# EAGLE design ArduinoV01 (EAGLE 7.7.0)
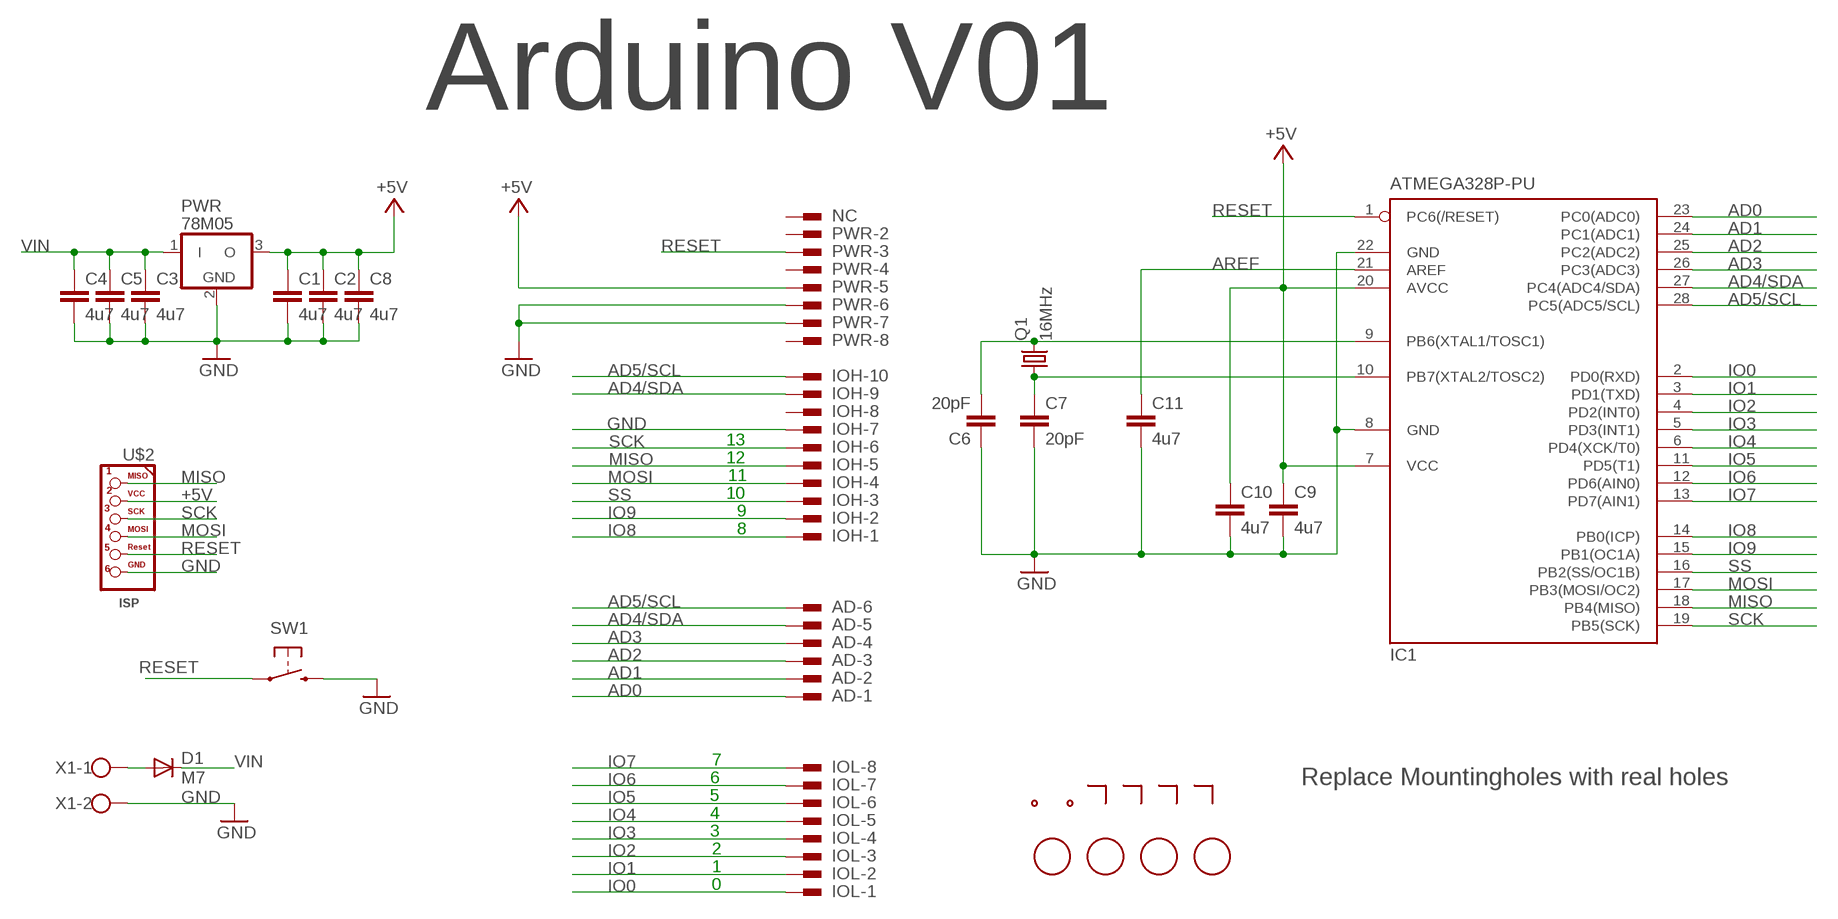
[diagram p0: schematic, sheet 1]

## Parts
AD-1  PINHD-1X1  [1X01]
AD-2  PINHD-1X1  [1X01]
AD-3  PINHD-1X1  [1X01]
AD-4  PINHD-1X1  [1X01]
AD-5  PINHD-1X1  [1X01]
AD-6  PINHD-1X1  [1X01]
C1  4u7  C-EUC0805  [C0805]
C2  4u7  C-EUC0805  [C0805]
C3  4u7  C-EUC0805  [C0805]
C4  4u7  C-EUC0805  [C0805]
C5  4u7  C-EUC0805  [C0805]
C6  20pF  C-EUC0805  [C0805]
C7  20pF  C-EUC0805  [C0805]
C8  4u7  C-EUC0805  [C0805]
C9  4u7  C-EUC0805  [C0805]
C10  4u7  C-EUC0805  [C0805]
C11  4u7  C-EUC0805  [C0805]
D1  M7  DIODE-DO214AC  [DO214AC]
FD1  FIDUCIALMOUNT  [FIDUCIA-MOUNT]
FD2  FIDUCIALMOUNT  [FIDUCIA-MOUNT]
FD3  FIDUCIALMOUNT  [FIDUCIA-MOUNT]
FD4  FIDUCIALMOUNT  [FIDUCIA-MOUNT]
IC1  ATMEGA328P-PU  [DIL28-3]
IOH-1  PINHD-1X1  [1X01]
IOH-2  PINHD-1X1  [1X01]
IOH-3  PINHD-1X1  [1X01]
IOH-4  PINHD-1X1  [1X01]
IOH-5  PINHD-1X1  [1X01]
IOH-6  PINHD-1X1  [1X01]
IOH-7  PINHD-1X1  [1X01]
IOH-8  PINHD-1X1  [1X01]
IOH-9  PINHD-1X1  [1X01]
IOH-10  PINHD-1X1  [1X01]
IOL-1  PINHD-1X1  [1X01]
IOL-2  PINHD-1X1  [1X01]
IOL-3  PINHD-1X1  [1X01]
IOL-4  PINHD-1X1  [1X01]
IOL-5  PINHD-1X1  [1X01]
IOL-6  PINHD-1X1  [1X01]
IOL-7  PINHD-1X1  [1X01]
IOL-8  PINHD-1X1  [1X01]
NC  PINHD-1X1  [1X01]
PWR  78M05  7805DPACK  [DPACK]
PWR-2  PINHD-1X1  [1X01]
PWR-3  PINHD-1X1  [1X01]
PWR-4  PINHD-1X1  [1X01]
PWR-5  PINHD-1X1  [1X01]
PWR-6  PINHD-1X1  [1X01]
PWR-7  PINHD-1X1  [1X01]
PWR-8  PINHD-1X1  [1X01]
Q1  16MHz  CRYSTALHC49S  [HC49/S]
SW1  SWITCH1X2  [SW8X4-SMD]
U$1  MARKERDUAL-90  [MARKER90]
U$2  ISPE  [2X03EDGE]
U$3  MARKER  [MARKER]
U$4  MARKER  [MARKER]
U$5  MARKER  [MARKER]
U$6  MARKER  [MARKER]
X1  SCREWTERMINATOR1X2V  [W237-102V]

## Nets
+5V [usbvcc]: C1.1 C2.1 C8.1 C9.1 C10.1 IC1.7(VCC) IC1.20(AVCC) PWR-5.1 PWR.3(O) U$2.P$2
AD0: AD-1.1 IC1.23(PC0(ADC0))
AD1: AD-2.1 IC1.24(PC1(ADC1))
AD2: AD-3.1 IC1.25(PC2(ADC2))
AD3: AD-4.1 IC1.26(PC3(ADC3))
AD4/SDA: AD-5.1 IC1.27(PC4(ADC4/SDA)) IOH-9.1
AD5/SCL: AD-6.1 IC1.28(PC5(ADC5/SCL)) IOH-10.1
AREF [aref]: C11.1 IC1.21(AREF)
GND [gnd]: C1.2 C2.2 C3.2 C4.2 C5.2 C6.1 C7.2 C8.2 C9.2 C10.2 C11.2 IC1.8(GND) IC1.22(GND) IOH-7.1 PWR-6.1 PWR-7.1 PWR.2(GND) SW1.2(S) U$2.P$6 X1.2
IO0: IC1.2(PD0(RXD)) IOL-1.1
IO1: IC1.3(PD1(TXD)) IOL-2.1
IO2: IC1.4(PD2(INT0)) IOL-3.1
IO3: IC1.5(PD3(INT1)) IOL-4.1
IO4: IC1.6(PD4(XCK/T0)) IOL-5.1
IO5: IC1.11(PD5(T1)) IOL-6.1
IO6: IC1.12(PD6(AIN0)) IOL-7.1
IO7: IC1.13(PD7(AIN1)) IOL-8.1
IO8: IC1.14(PB0(ICP)) IOH-1.1
IO9: IC1.15(PB1(OC1A)) IOH-2.1
MISO: IC1.18(PB4(MISO)) IOH-5.1 U$2.P$1
MOSI: IC1.17(PB3(MOSI/OC2)) IOH-4.1 U$2.P$4
N$1: C6.2 IC1.9(PB6(XTAL1/TOSC1)) Q1.2
N$2: C7.1 IC1.10(PB7(XTAL2/TOSC2)) Q1.1
N$3: D1.A X1.1
RESET: IC1.1(PC6(/RESET)) PWR-3.1 SW1.1(P) U$2.P$5
SCK: IC1.19(PB5(SCK)) IOH-6.1 U$2.P$3
SS: IC1.16(PB2(SS/OC1B)) IOH-3.1
VIN [power]: C3.1 C4.1 C5.1 D1.C PWR.1(I)
Unconnected: IOH-8.1 NC.1 PWR-2.1 PWR-4.1 PWR-8.1

## Notes on the sheet
- Arduino V01
- 13
- 12
- 11
- 10
- 9
- 8
- 7
- 6 | Replace Mountingholes with real holes
- 5
- 4
- 3
- 2
- 1
- 0

## Library data of the parts
AD-1-AD-6 IOH-1-IOH-10 IOL-1-IOL-8 NC PWR-2-PWR-8 = MyLib:PINHD-1X1: Connector 1 pin; MF: TYCO ELECTRONICS; MPN: 62221-1; OC_FARNELL: unknown; OC_NEWARK: 16H2318
C1-C11 = rcl:C-EU: CAPACITOR, European symbol
D1 = MyLib:DIODE: DIODE Diode
FD1-FD4 = SmartPrj:FIDUCIALMOUNT
IC1 = Itead_IC_110429:ATMEGA328P-PU: ICC002
PWR = MyLib:7805: Voltage regulator 3 pin
Q1 = MyLib:CRYSTAL: CRYSTAL; OC_FARNELL: 1667008; OC_NEWARK: unknown
SW1 = MyLib:SWITCH1X2
U$1 = MyLib:MARKERDUAL: Marker for Duallayer boards
U$2 = MyLib:ISP
U$3-U$6 = MyLib:MARKER: Marker pad without connections
X1 = MyLib:SCREWTERMINATOR1X2: WAGO SCREW CLAMP

## Net classes
0 default: width 0.254 mm, clearance 0.254 mm
1 power: width 0.61 mm, drill 0.61 mm, clearance 0.254 mm
2 gnd: width 0.305 mm, drill 0.559 mm, clearance 0.254 mm
3 usbvcc: width 0.508 mm, drill 0.61 mm, clearance 0.254 mm
4 aref: width 0.406 mm, drill 0.61 mm, clearance 0.254 mm

## Board
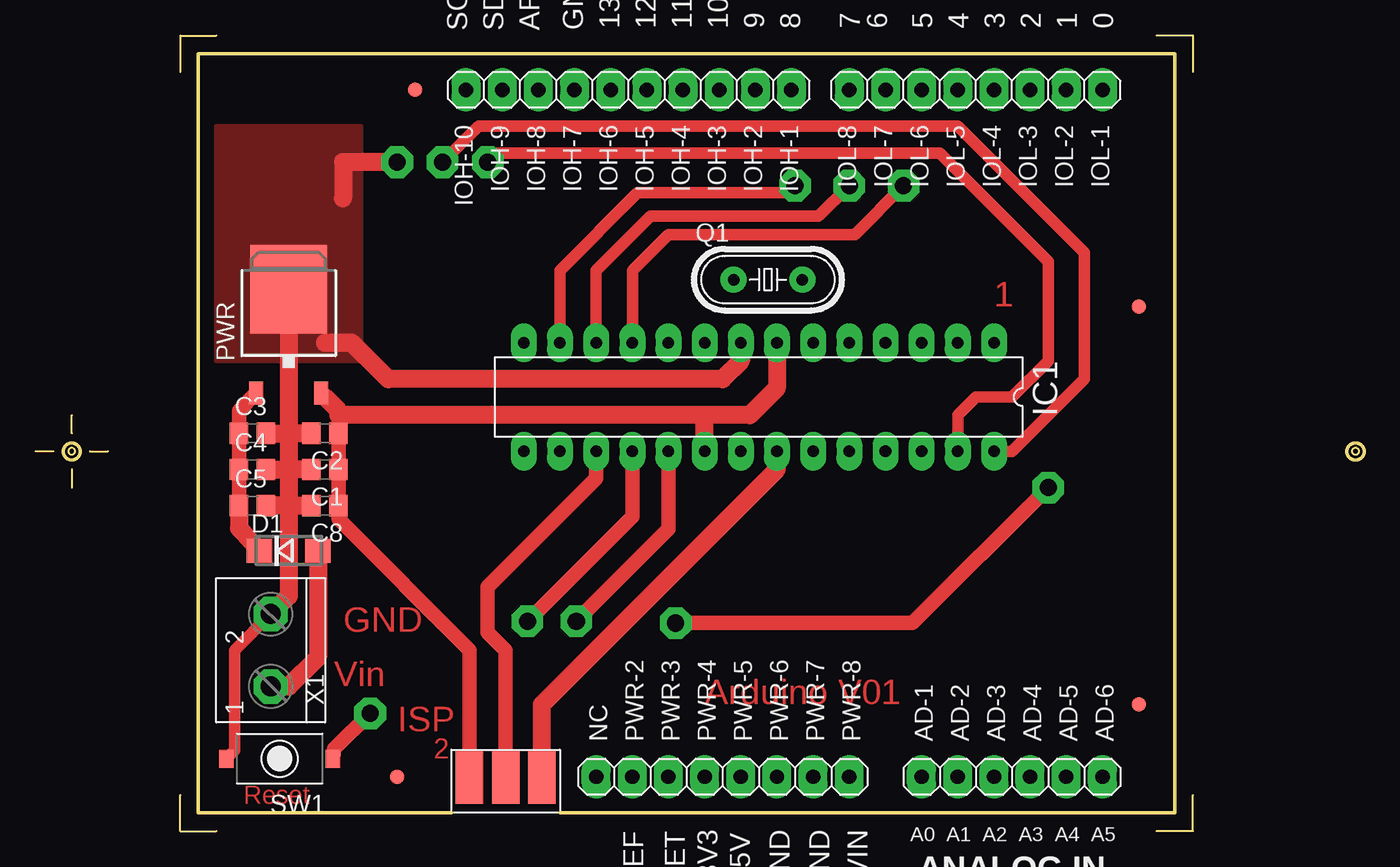
[diagram p1: board, top side]
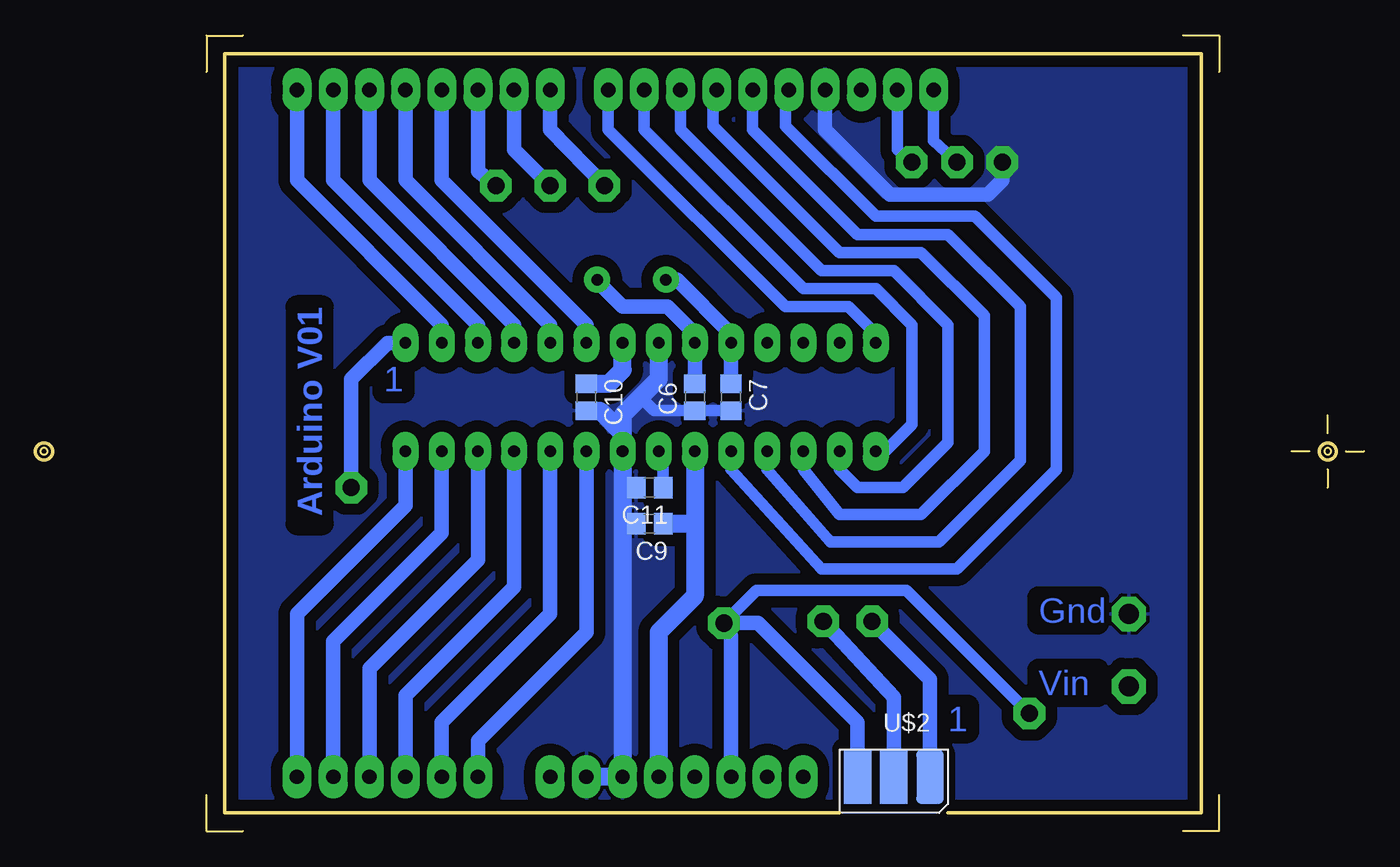
[diagram p2: board, bottom side, seen from below]

Size 93.29 x 55.88 mm. Coordinates in mm from the lower left corner, seen from the top.
Outline: 36.83,1.27 80.01,1.27 80.01,54.61 11.43,54.61 11.43,1.27 29.21,1.27
Copper layers (1*16): Top 0.035mm / dielectric 1.5mm / Bottom 0.035mm
Design rules "default *": minimum track width 10mil, minimum drill 22mil, track to track 16mil, track to pad 16mil, pad to pad 10mil, via to via 16mil, smd to smd 8mil, copper to edge 26mil, drill to drill 12mil, minimum pad ring 20mil, minimum via ring 20mil, stop-mask expansion 1mil, vias tented up to drill 30mil, thermal gap 10mil

### Footprints (pad centres in the part's own frame; a part is rotated, then mirrored left to right if it is on the bottom)
1X01 = drill 1.016 long: 1 0,0
C0805 = smd 1.3 x 1.5: 1 -0.95,0; 2 0.95,0
DO214AC = smd 1.8 x 1.7: A 2.05,0; C -2.05,0
FIDUCIA-MOUNT = smd 1.016 x 1.016: P$1 0,0
DIL28-3 = drill 0.813 long: 1 -16.51,-3.81; 2 -13.97,-3.81; 3 -11.43,-3.81; 4 -8.89,-3.81; 5 -6.35,-3.81; 6 -3.81,-3.81; 7 -1.27,-3.81; 8 1.27,-3.81; 9 3.81,-3.81; 10 6.35,-3.81; 11 8.89,-3.81; 12 11.43,-3.81; 13 13.97,-3.81; 14 16.51,-3.81; 15 16.51,3.81; 16 13.97,3.81; 17 11.43,3.81; 18 8.89,3.81; 19 6.35,3.81; 20 3.81,3.81; 21 1.27,3.81; 22 -1.27,3.81; 23 -3.81,3.81; 24 -6.35,3.81; 25 -8.89,3.81; 26 -11.43,3.81; 27 -13.97,3.81; 28 -16.51,3.81
DPACK = smd 1 x 1.6: 1 -2.28,-4.8; 3 2.28,-4.8 | smd 5.4 x 6.2: 2 0,2.5
HC49/S = drill 0.813: 1 -2.413,0; 2 2.413,0
SW8X4-SMD = smd 1.27 x 1.016: 1 0,-3.75; 2 0,3.75
2X03EDGE = smd 1.93 x 3.81: P$1 2.54,0; P$3 0,0; P$5 -2.54,0 | smd 1.93 x 3.81 bottom: P$2 2.54,0; P$4 0,0; P$6 -2.54,0
W237-102V = drill 1.4 pad 2.3 octagon: 1 -2.54,0; 2 2.54,0

### Placement (x,y rotation side)
AD-1  62.23,3.81 0 top
AD-2  64.77,3.81 0 top
AD-3  67.31,3.81 0 top
AD-4  69.85,3.81 0 top
AD-5  72.39,3.81 0 top
AD-6  74.93,3.81 0 top
C1  20.32,25.4 180 top
C2  20.32,27.94 180 top
C3  15.24,27.94 0 top
C4  15.24,25.4 0 top
C5  15.24,22.86 0 top
C6  46.99,30.48 90 bottom
C7  44.45,30.48 270 bottom
C8  20.32,22.86 180 top
C9  50.16,21.59 180 bottom
C10  54.61,30.48 270 bottom
C11  50.16,24.13 180 bottom
D1  17.78,19.68 0 top
FD1  26.67,52.07 0 top
FD2  77.47,8.89 0 top
FD3  25.4,3.81 0 top
FD4  77.47,36.83 0 top
IC1  50.8,30.48 180 top
IOH-1  53.09,52.07 180 top
IOH-2  50.55,52.07 180 top
IOH-3  48.01,52.07 180 top
IOH-4  45.47,52.07 180 top
IOH-5  42.93,52.07 180 top
IOH-6  40.39,52.07 180 top
IOH-7  37.85,52.07 180 top
IOH-8  35.31,52.07 180 top
IOH-9  32.77,52.07 180 top
IOH-10  30.23,52.07 180 top
IOL-1  74.93,52.07 180 top
IOL-2  72.39,52.07 180 top
IOL-3  69.85,52.07 180 top
IOL-4  67.31,52.07 180 top
IOL-5  64.77,52.07 180 top
IOL-6  62.23,52.07 180 top
IOL-7  59.69,52.07 180 top
IOL-8  57.15,52.07 180 top
NC  39.37,3.81 0 top
PWR  17.78,35.56 0 top
PWR-2  41.91,3.81 0 top
PWR-3  44.45,3.81 0 top
PWR-4  46.99,3.81 0 top
PWR-5  49.53,3.81 0 top
PWR-6  52.07,3.81 0 top
PWR-7  54.61,3.81 0 top
PWR-8  57.15,3.81 0 top
Q1  51.44,38.74 0 top
SW1  17.14,5.08 90 top
U$1  2.54,26.67 0 top
U$2  33.02,3.81 0 bottom
U$3  10.16,55.88 0 top
U$4  81.28,55.88 270 top
U$5  10.16,0 90 top
U$6  81.28,0 180 top
X1  16.51,12.7 90 top

### Tracks (layer width: path | path; a pad name or v marks a point on that pad's centre or on a via)
+5V
  Top 1.016: PWR.3 21.27,29.55 21.27,29.21 C2.1 C1.1 C8.1 21.27,21.91 30.48,12.7 U$2.P$2
  Top 1.27: IC1.7 52.07,31.11 50.16,29.21 46.99,29.21 | 46.99,29.21 21.27,29.21 21.27,29.53 20.32,30.48 | IC1.20 46.99,29.21
  Bottom 1.27: IC1.20 46.99,21.59 | 46.99,21.59 46.99,16.51 49.53,13.97 PWR-5.1 | C10.1 53.02,31.43 52.07,32.38 IC1.7 | C9.1 46.99,21.59
AD0
  Bottom 1.016: IC1.23 54.61,13.97 62.23,6.35 AD-1.1
AD1
  Bottom 1.016: IC1.24 57.15,15.24 64.77,7.62 AD-2.1
AD2
  Bottom 1.016: IC1.25 59.69,17.14 67.31,9.53 AD-3.1
AD3
  Bottom 1.016: AD-4.1 69.85,11.43 62.23,19.05 IC1.26
AD4/SDA  (via drill 1.2 pad 2)
  Top 0.813: v31.75,46.99 32.38,47.62 63.5,47.62 71.12,40.01 71.12,33.02 68.58,30.48 66.04,30.48 64.77,29.21 IC1.27
  Bottom 0.813: IOH-9.1 32.77,47.88 v31.75,46.99
  Bottom 1.016: AD-5.1 72.39,13.33 64.77,20.95 IC1.27
AD5/SCL  (via drill 1.2 pad 2)
  Top 0.813: v28.57,46.99 31.11,49.53 64.77,49.53 73.66,40.64 73.66,31.75 68.58,26.67 IC1.28
  Bottom 0.813: IOH-10.1 30.23,48.51 v28.57,46.99
  Bottom 1.016: AD-6.1 74.93,15.24 67.31,22.86 IC1.28
AREF
  Bottom 0.813: C11.1 49.21,26.36 IC1.21
GND  (via drill 1.2 pad 2)
  Top 0.813: X1.2 13.97,12.7 13.97,5.65 SW1.2
  Top 1.27: PWR.2 17.78,27.94 | 17.78,27.94 17.78,25.4 | 17.78,25.4 17.78,22.86 | 17.78,22.86 C5.2 | 17.78,22.86 C8.2 | C4.2 17.78,25.4 | C3.2 17.78,27.94 | C2.2 17.78,27.94 | C1.2 17.78,25.4 | IC1.8 49.53,33.02 48.26,31.75 24.77,31.75 22.23,34.29 20.32,34.29 | U$2.P$6 35.56,8.89 52.07,25.4 IC1.22 | v25.4,46.99 21.59,46.99 21.59,44.45 | 17.78,22.86 17.78,16.51 X1.2
  Bottom 0.813: C7.2 C6.1 49.85,29.53 50.8,30.48 | C11.2 52.07,24.13
  Bottom 1.016: IOH-7.1 37.85,49.28 33.27,44.7 26.42,44.7 25.4,45.72 v25.4,46.99
  Bottom 1.27: IC1.8 49.53,31.75 50.8,30.48 52.07,29.21 52.07,27.94 | 52.07,27.94 IC1.22 52.07,24.13 52.07,21.59 | 52.07,21.59 PWR-6.1 PWR-7.1 | C10.2 53.66,29.53 52.07,27.94 | C9.2 52.07,21.59
  pour Top (isolate 0.61, no thermals): 12.7,49.53 12.7,33.02 22.86,33.02 22.86,49.53
  pour Bottom (isolate 0.813): 11.43,54.61 80.01,54.61 80.01,1.27 11.43,1.27
IO0
  Bottom 1.016: IC1.2 64.77,35.56 74.93,45.72 IOL-1.1
IO1
  Bottom 1.016: IC1.3 62.23,35.56 72.39,45.72 IOL-2.1
IO2
  Bottom 1.016: IC1.4 59.69,35.56 69.85,45.72 IOL-3.1
IO3
  Bottom 1.016: IC1.5 57.15,35.56 67.31,45.72 IOL-4.1
IO4
  Bottom 1.016: IC1.6 54.61,35.56 64.77,45.72 IOL-5.1
IO5  (via drill 1.2 pad 2)
  Top 0.813: IC1.11 41.91,39.37 44.45,41.91 57.53,41.91 v60.96,45.34
  Bottom 1.016: v60.96,45.34 62.23,46.36 IOL-6.1
IO6  (via drill 1.2 pad 2)
  Top 0.813: IC1.12 39.37,39.37 43.18,43.18 54.99,43.18 v57.15,45.34
  Bottom 1.016: v57.15,45.34 59.69,47.88 IOL-7.1
IO7  (via drill 1.2 pad 2)
  Top 0.813: IC1.13 36.83,39.37 42.29,44.83 52.83,44.83 v53.34,45.34
  Bottom 1.016: v53.34,45.34 57.15,49.28 IOL-8.1
IO8
  Bottom 0.813: IOH-1.1 53.09,49.28 40.64,36.83 36.2,36.83 34.29,34.93 IC1.14
IO9
  Bottom 0.813: IOH-2.1 50.55,49.28 39.37,38.1 34.29,38.1 31.75,35.56 31.75,28.57 33.66,26.67 IC1.15
MISO  (via drill 1.2 pad 2)
  Top 1.016: v34.54,14.73 41.91,22.1 IC1.18
  Bottom 0.813: IOH-5.1 42.93,49.28 35.56,41.91 29.21,41.91 24.13,36.83 24.13,26.04 29.84,20.32 37.47,20.32 41.91,25.4 IC1.18
  Bottom 1.016: U$2.P$1 30.48,10.67 v34.54,14.73
MOSI
  Top 1.016: IC1.17 39.37,24.77 31.75,17.14 31.75,13.97 33.02,12.7 U$2.P$4
  Bottom 0.813: IOH-4.1 45.72,51.82 45.72,49.53 36.83,40.64 31.11,40.64 26.67,36.2 26.67,26.67 31.11,22.22 36.83,22.22 39.37,25.4 IC1.17
N$1
  Bottom 0.813: IC1.9 46.99,34.93 | 53.98,38.86 Q1.2
  Bottom 1.016: 46.99,34.93 48.9,36.83 52.07,36.83 53.34,38.1 53.98,38.86 | C6.2 IC1.9
N$2
  Bottom 1.016: Q1.1 48.26,38.74 44.45,34.93 IC1.10 C7.1
N$3
  Top 1.27: D1.A 19.83,12.21 17.78,10.16 X1.1
RESET  (via drill 1.2 pad 2)
  Top 1.016: v71.12,24.13 61.59,14.61 v44.96,14.61 | v23.49,8.26 20.95,5.78 SW1.1
  Bottom 0.813: v23.49,8.26 32.13,16.89 42.67,16.89 v44.96,14.61
  Bottom 1.016: v71.12,24.13 71.12,31.75 68.58,34.29 IC1.1 | U$2.P$5 35.56,7.62 42.55,14.61 v44.96,14.61 44.96,14.22 44.45,13.72 PWR-3.1
SCK  (via drill 1.2 pad 2)
  Top 1.016: v37.97,14.73 44.45,21.21 IC1.19
  Bottom 0.813: IC1.19 44.45,25.4 38.1,18.41 28.57,18.41 21.59,25.4 21.59,37.47 27.3,43.18 34.29,43.18 40.64,49.53 40.64,51.82 IOH-6.1
  Bottom 1.016: U$2.P$3 33.02,9.4 v37.97,14.73
SS
  Bottom 0.813: IOH-3.1 48.01,49.28 38.1,39.37 33.02,39.37 29.21,35.56 29.21,27.3 32.38,24.13 35.56,24.13 36.83,25.4 IC1.16
VIN
  Top 1.016: C5.1 C4.1 C3.1 14.29,29.55 PWR.1
  Top 1.27: C5.1 14.29,21.27 14.61,20.95 D1.C

### Text on the board
Top: 1 | GND | Vin | Arduino V01 | ISP | 2 | Reset
Bottom: Arduino V01 | 1 | Gnd | Vin | 1
tPlace: 13 | 12 | 11 | 10 | 9 | 8 | 7 | 6 | 5 | 4 | 3 | 2 | 1 | 0
tNames: TX | RX | SCL | SDA | AREF | GND | IOREF | RESET | 3V3 | 5V | GND | GND | VIN | A0 | A1 | A2 | A3 | A4 | A5 | ANALOG IN
214bmp: D:/SmartProjects/Snc/a4_bn_logo2.bmp